# EAGLE design board (EAGLE 6.5.0)
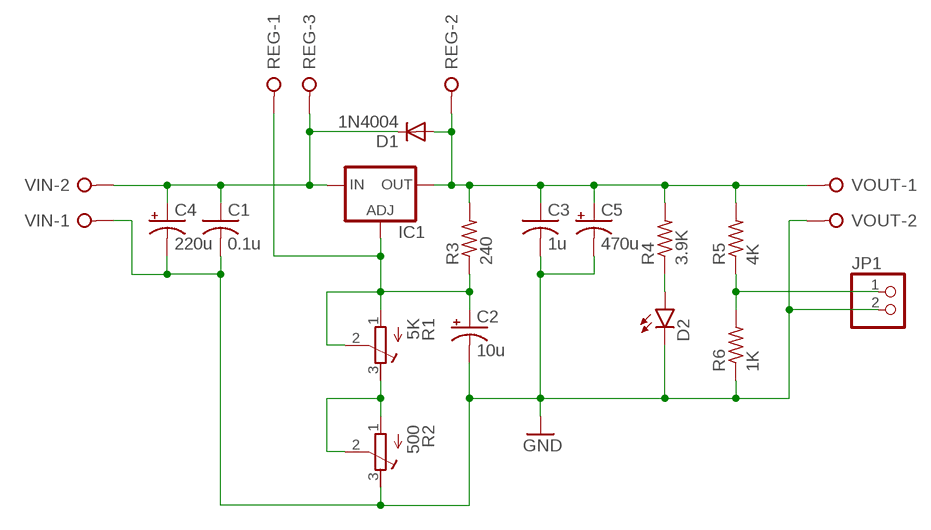
[diagram p0: schematic, sheet 1]

## Parts
C1  0.1u  C-USC1206  [C1206]
C2  10u  CPOL-USE2-5  [E2-5]
C3  1u  C-USC1206  [C1206]
C4  220u  CPOL-USE5-10.5  [E5-10,5]
C5  470u  CPOL-USE5-13  [E5-13]
D1  1N4004  [DO41-10]
D2  LED1206  [LED-1206]
IC1  LM317TS  [317TS]
JP1  PINHD-1X2  [1X02]
R1  5K  R-TRIMM3296W  [RTRIM3296W]
R2  500  R-TRIMM3296W  [RTRIM3296W]
R3  240  R-US_0309/10  [0309/10]
R4  3.9K  R-US_R1206  [R1206]
R5  4K  R-US_R1206  [R1206]
R6  1K  R-US_R1206  [R1206]
REG  W237-3E  [W237-3E]
VIN  W237-02P  [W237-132]
VOUT  W237-02P  [W237-132]

## Nets
GND: C1.2 C2.- C3.2 C4.- C5.- D2.C JP1.2 R2.3(E) R6.1 VIN.1 VOUT.2
N$1: C1.1 C4.+ D1.C IC1.3(IN) REG.3 VIN.2
N$2: D2.A R4.1
N$3: C2.+ IC1.1(ADJ) R1.1(A) R1.2(S) R3.1 REG.1
N$4: R1.3(E) R2.1(A) R2.2(S)
N$5: JP1.1 R5.1 R6.2
N$6: C3.1 C5.+ D1.A IC1.2(OUT) R3.2 R4.2 R5.2 REG.2 VOUT.1

## Library data of the parts
C1 C3 = rcl:C-US: CAPACITOR, American symbol
C2 C4 C5 = rcl:CPOL-US: POLARIZED CAPACITOR, American symbol
D1 = diode:1N4004: DIODE general purpose rectifier, 1 A
D2 = SparkFun-LED:LED: LEDs Standard schematic elements and footprints for 5mm, 3mm, 1206, and 0603 sized LEDs. 5mm - Spark Fun Electronics SKU : COM-00529 (and others)
IC1 = v-reg:LM317TS: VOLTAGE REGULATOR
JP1 = pinhead:PINHD-1X2: PIN HEADER
R1 R2 = rcl:R-TRIMM: Trimm resistor
R3-R6 = rcl:R-US_: RESISTOR, American symbol
REG = con-wago-508:W237-3E: WAGO SREW CLAMP; OC_FARNELL: unknown; OC_NEWARK: unknown
VIN VOUT = con-wago-508:W237-02P: WAGO SREW CLAMP; OC_FARNELL: unknown; OC_NEWARK: unknown

## Board
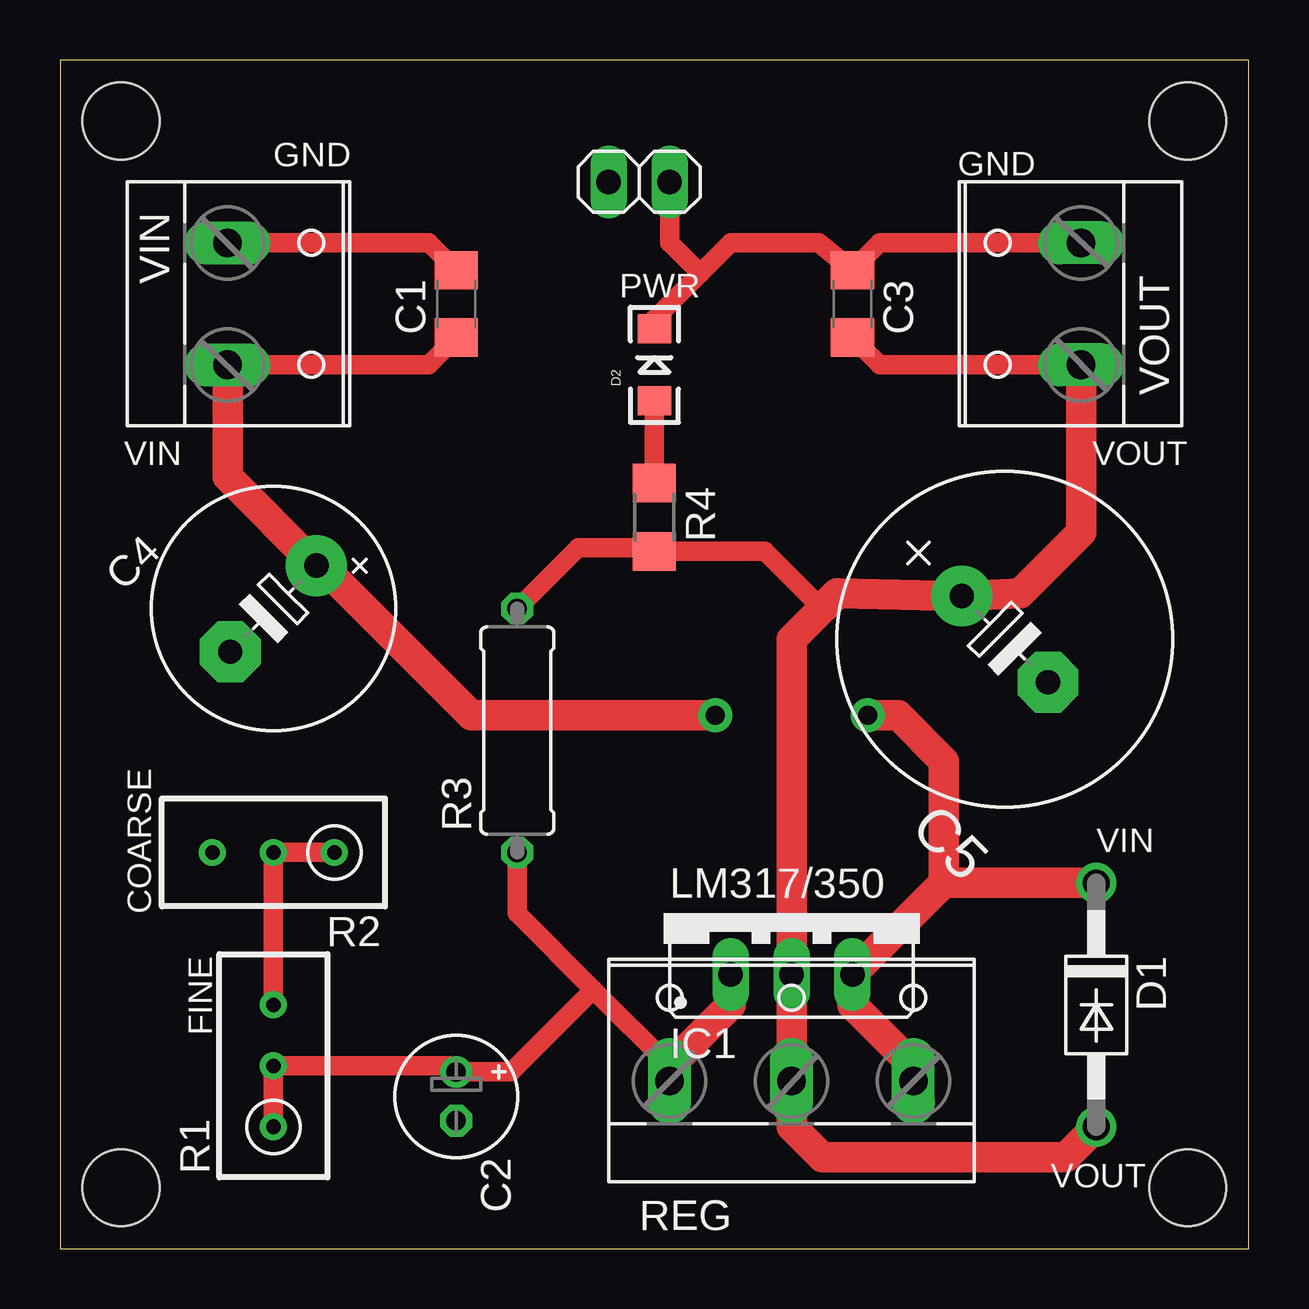
[diagram p1: board, top side]
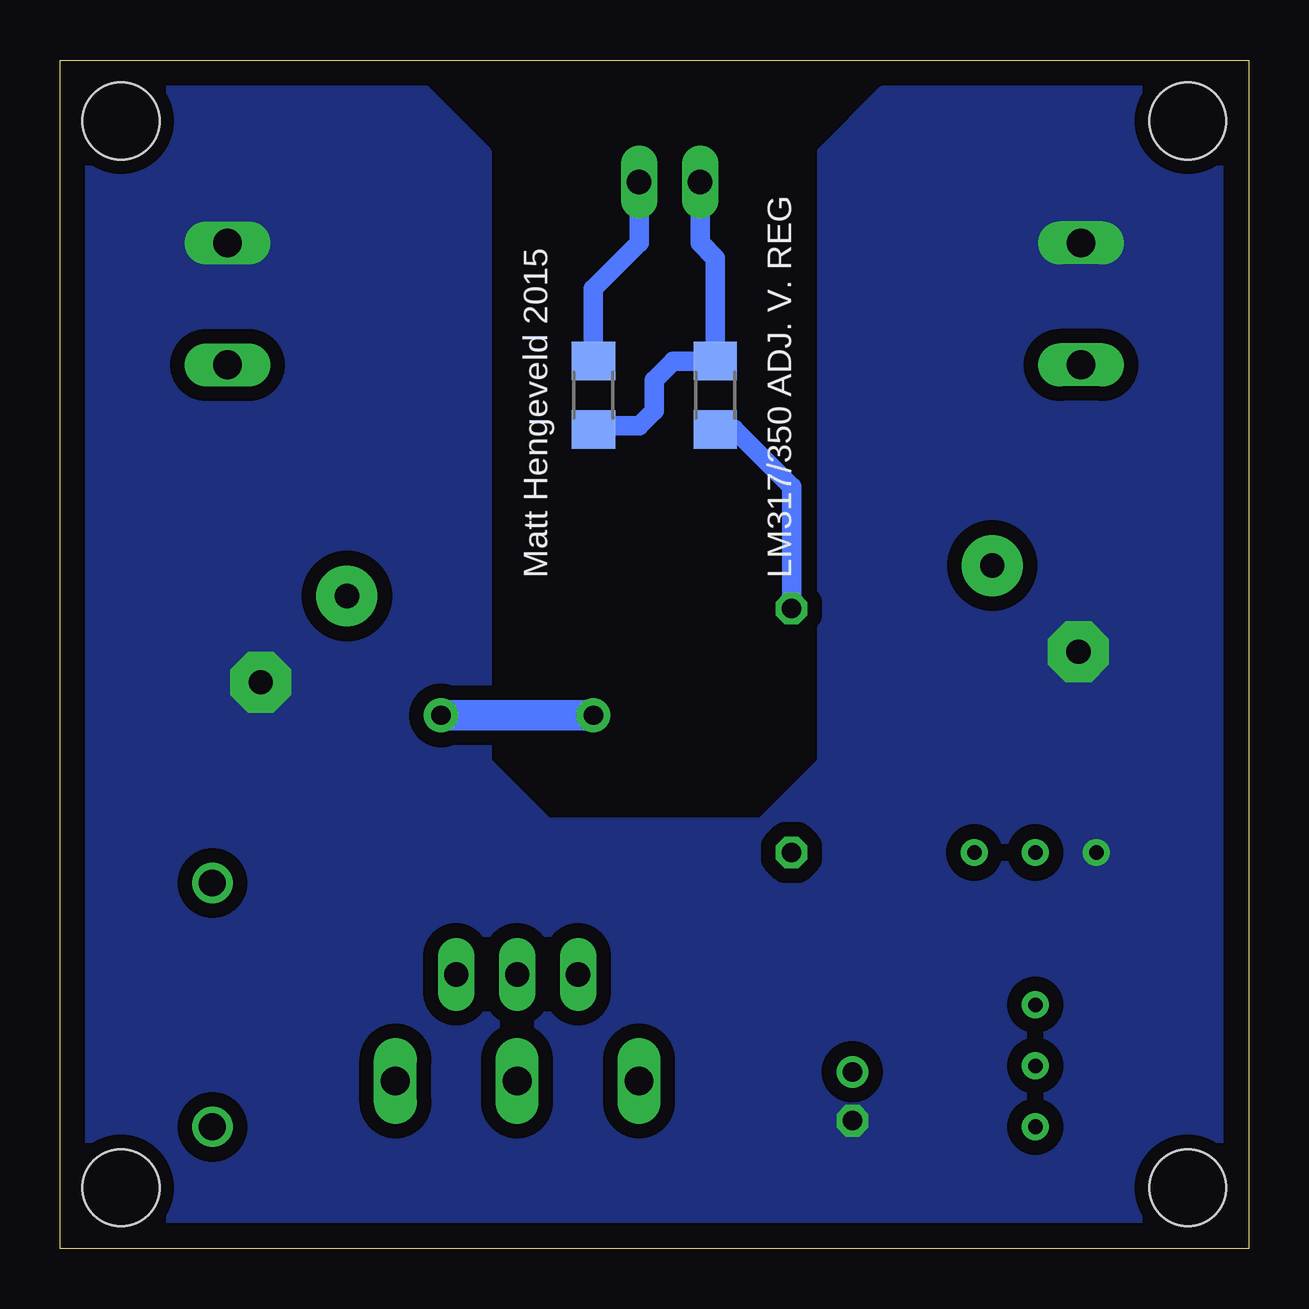
[diagram p2: board, bottom side, seen from below]

Size 49.53 x 49.53 mm. Coordinates in mm from the lower left corner, seen from the top.
Outline: 0,0 49.53,0 49.53,49.53 0,49.53 0,0
Copper layers (1*16): Top 0.035mm / dielectric 1.5mm / Bottom 0.035mm
Design rules "SeeedStudio_2layer_DRU_no_angle_20140221": minimum track width 6mil, minimum drill 12mil, track to track 6mil, track to pad 6mil, pad to pad 6mil, via to via 6mil, smd to smd 0mil, copper to edge 10mil, drill to drill 10mil, minimum pad ring 10mil, minimum via ring 6mil, stop-mask expansion 2mil, vias tented up to drill 100mil, thermal gap 10mil
Holes 3.2 mm at 2.54,46.99 46.99,46.99 46.99,2.54 2.54,2.54

### Footprints (pad centres in the part's own frame; a part is rotated, then mirrored left to right if it is on the bottom)
C1206 = smd 1.6 x 1.8: 1 -1.4,0; 2 1.4,0
E2-5 = drill 0.813 pad 1.27: + -1.016,0 | drill 0.813 pad 1.27 octagon: - 1.016,0
E5-10,5 = drill 1.016 pad 2.54: + -2.54,0 | drill 1.016 pad 2.54 octagon: - 2.54,0
E5-13 = drill 1.016 pad 2.54: + -2.54,0 | drill 1.016 pad 2.54 octagon: - 2.54,0
DO41-10 = drill 1.118: A 5.08,0; C -5.08,0
LED-1206 = smd 1.2 x 1.4: A -1.5,0; C 1.5,0
317TS = drill 1.016 long: 1 -2.54,-2.54; 2 0,-2.54; 3 2.54,-2.54
1X02 = drill 1.016 long: 1 -1.27,0; 2 1.27,0
RTRIM3296W = drill 0.61: 1 0,-2.54; 2 0,0; 3 0,2.54
0309/10 = drill 0.813 octagon: 1 -5.08,0; 2 5.08,0
R1206 = smd 1.6 x 1.803: 1 -1.422,0; 2 1.422,0
W237-3E = drill 1.194 long: 1 -5.08,-0.635; 2 0,-0.635; 3 5.08,-0.635
W237-132 = drill 1.194 long: 1 -2.54,-0.635; 2 2.54,-0.635

### Placement (x,y rotation side)
C1  16.51,39.37 90 top
C2  16.51,6.35 270 top
C3  33.02,39.37 90 top
C4  8.89,26.67 225 top
C5  39.37,25.4 315 top
D1  43.18,10.16 270 top
D2  24.77,36.83 90 top
IC1  30.48,13.97 0 top
JP1  24.13,44.45 0 top
R1  8.89,7.62 0 top
R2  8.89,16.51 90 top
R3  19.05,21.59 90 top
R4  24.77,30.48 270 top
R5  22.23,35.56 270 bottom
R6  27.3,35.56 270 bottom
REG  30.48,7.62 0 top
VIN  7.62,39.37 270 top
VOUT  41.91,39.37 90 top

### Tracks (layer width: path | path; a pad name or v marks a point on that pad's centre or on a via)
GND
  Top 0.813: VIN.1 15.37,41.91 C1.2 | VOUT.2 34.16,41.91 C3.2 31.62,41.91 27.94,41.91 26.67,40.64 | D2.C 24.77,38.73 26.67,40.64 | JP1.2 25.4,41.91 26.67,40.64
  Bottom 0.813: R6.1 27.3,40.01 25.4,41.91 JP1.2
  pour Bottom (isolate 0.61, no thermals): 45.72,48.26 34.29,48.26 31.75,45.72 31.75,20.32 29.21,17.78 20.32,17.78 17.78,20.32 17.78,45.72 15.24,48.26 3.81,48.26 1.27,45.72 1.27,3.81 3.81,1.27 45.72,1.27 48.26,3.81 48.26,45.72
N$1  (via drill 0.8 pad 1.42)
  Top 0.813: VIN.2 15.37,36.83 C1.1
  Top 1.27: REG.3 35.56,7.62 33.02,10.16 IC1.3 36.83,15.24 | v33.66,22.23 34.92,22.23 36.83,20.32 36.83,15.24 | D1.C 36.83,15.24 | VIN.2 6.99,32.17 C4.+ 10.9,28.47 17.14,22.23 v27.3,22.23
  Bottom 1.27: v27.3,22.23 v33.66,22.23
N$2
  Top 0.813: R4.1 D2.A
N$3
  Top 0.813: R1.1 R1.2 16.26,7.62 C2.+ 18.8,7.37 22.23,10.79 | 22.23,10.79 19.05,13.97 R3.1 | 22.23,10.79 25.4,7.62
  Top 1.27: REG.1 25.4,7.62 27.94,10.16 IC1.1
N$4
  Top 0.813: R2.1 R2.2 R1.3
N$5
  Bottom 0.813: R6.2 27.15,34.29 25.4,34.29 24.77,34.92 24.77,36.2 23.98,36.98 R5.1 22.23,41.27 22.86,41.91 JP1.1
N$6
  Top 0.813: 31.75,26.67 29.36,29.06 R4.2 24.61,29.21 21.59,29.21 R3.2 | VOUT.1 34.16,36.83 C3.1
  Top 1.27: D1.A 41.91,3.81 31.75,3.81 30.48,5.08 REG.2 IC1.2 30.48,25.4 31.75,26.67 32.38,27.3 C5.+ 40.01,27.3 42.55,29.84 VOUT.1
  Bottom 0.813: R5.2 21.44,34.14 19.05,31.75 R3.2

### Text on the board
tNames: GND | GND | PWR | VIN | VOUT | VIN | LM317/350 | COARSE | FINE | VOUT
bNames: LM317/350 ADJ. V. REG | Matt Hengeveld 2015